# EasyEDA schematic SCH_ESP32-Collar-Module_2024-04-16.json
TITLE: Sheet_1; REV: 1.0; Date: 2024-04-14; Sheet: 1/1; Drawn By: fcbayernmunchenerlan999; Company: Your Company
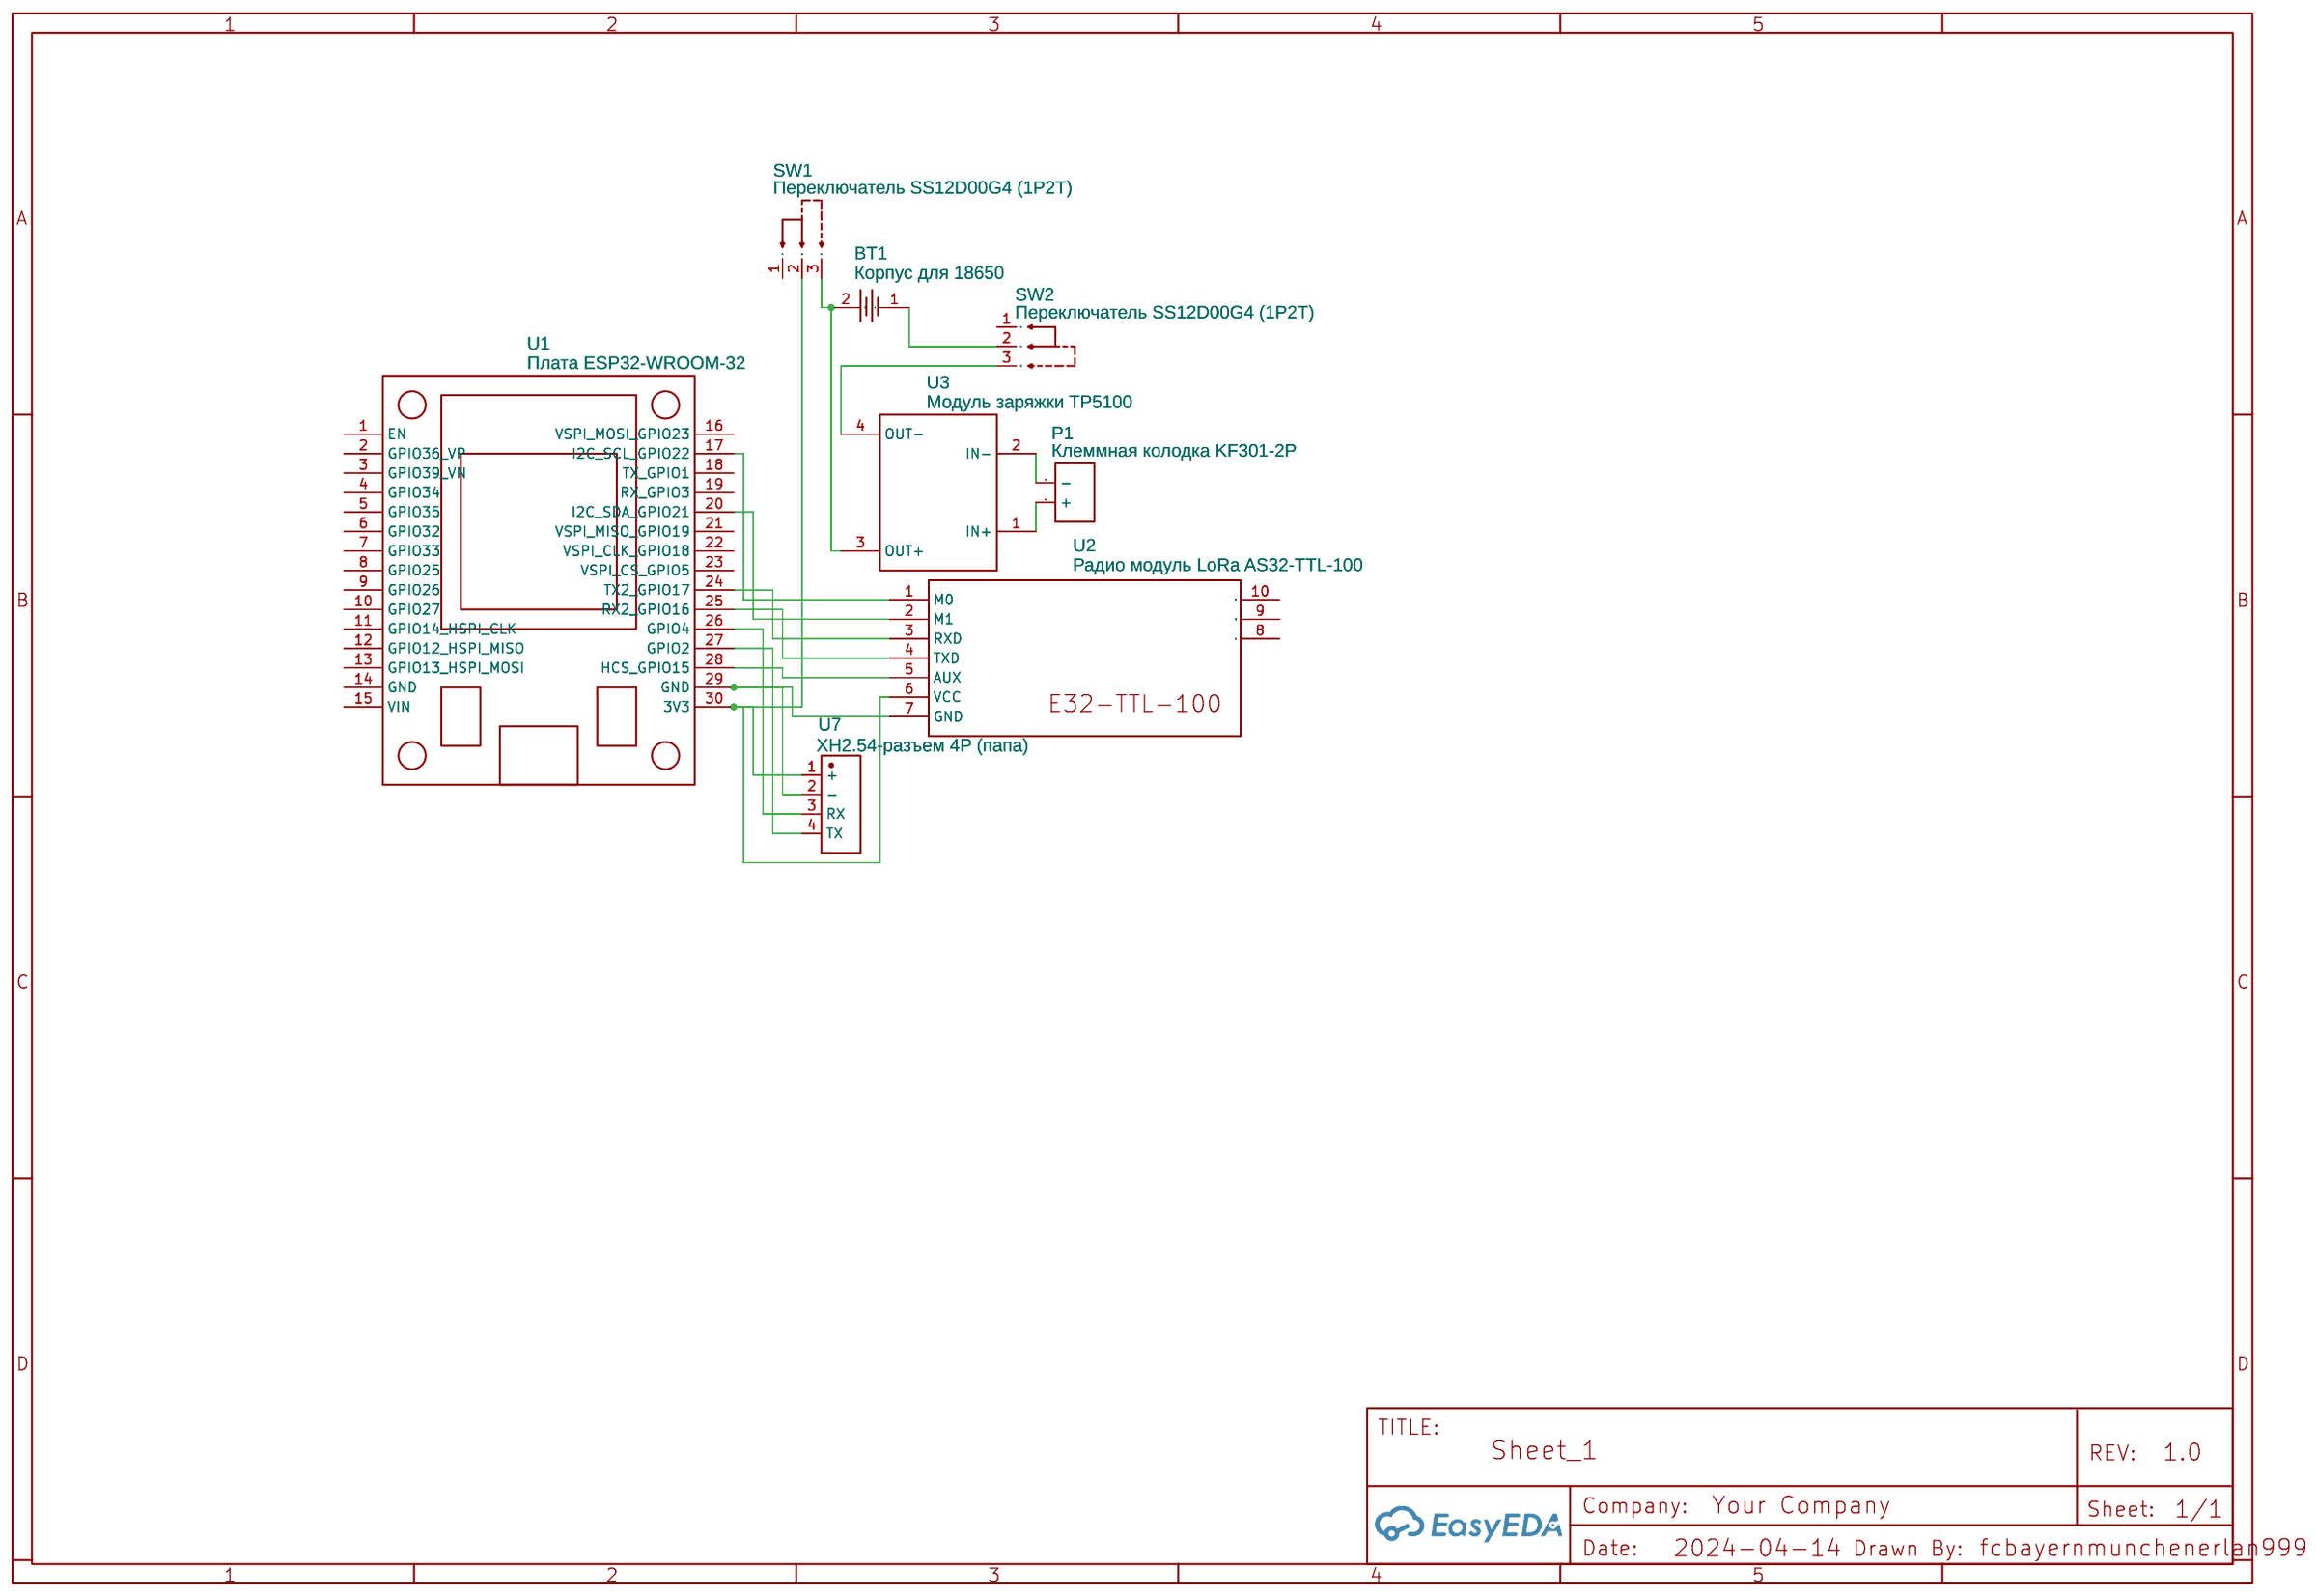
[diagram p0: schematic sheet]

## Parts
BT1  Корпус для 18650  [BAT-TH_BH-18650-A1AJ005]
P1  Клеммная колодка KF301-2P  [CONN-TH_2P-P5.00]
SW1  Переключатель SS12D00G4 (1P2T)  [SW-TH_G-SWITCH_SS-12E17-G020]
SW2  Переключатель SS12D00G4 (1P2T)  [SW-TH_G-SWITCH_SS-12E17-G020]
U1  Плата ESP32-WROOM-32  [ESP32S 30PIN DEVBOARD]
U2  Радио модуль LoRa AS32-TTL-100  [WIRELM-TH_E32-433T20DC]
U3  Модуль заряжки TP5100  [TP5100_MODULE_CHARGER]
U7  XH2.54-разъем 4P (папа)  [CONN-TH_4P-P2.50_ZX-XH2.54-4PWZ]

## Library data of the parts
BT1 = BH-18650-A1AJ005: Supplier: LCSC; Supplier Part: C5290176; Manufacturer: MYOUNG(美阳); JLCPCB Part Class: Extended Part; Contributor: lcsc; Package Display: No
P1 = CONN-TH_2P-P5.00: Supplier: LCSC; Contributor: LCEDA_Lib; Package Display: No
SW1 SW2 = SS-12E17-G020: Contributor: LCSC; Supplier: LCSC; Supplier Part: C2848909; Manufacturer: G-Switch(品赞); JLCPCB Part Class: Extended Part; Package Display: No
U1 = Плата ESP32 (вариант 2): Contributor: PhilD; Package Display: No
U2 = E32-TTL-100: Contributor: LCSC; Supplier: LCSC; Supplier Part: C97350; Manufacturer: EBYTE(亿佰特); Manufacturer Part: E32-433T20DC; JLCPCB Part Class: Extended Part; Package Display: No
U3 = TP5100_MODULE_CHARGER: Contributor: arve050; Package Display: No
U7 = ZX-XH2.54-4PWZ: Contributor: lcsc; Supplier: LCSC; Supplier Part: C7429643; Manufacturer: Megastar(兆星); JLCPCB Part Class: Extended Part; Package Display: No

## Nets
Net-(BT1-1): BT1.1 SW2.2
Net-(BT1-2): BT1.2 SW1.3 U3.3(OUT+)
Net-(P1-1): P1.1(-) U3.2(IN-)
Net-(P1-2): P1.2(+) U3.1(IN+)
Net-(SW1-2): SW1.2 U1.30(3V3) U2.6(VCC) U7.1(+)
Net-(SW2-3): SW2.3 U3.4(OUT-)
Net-(U1-17): U1.17(I2C SCL GPIO22) U2.1(M0)
Net-(U1-20): U1.20(I2C SDA GPIO21) U2.2(M1)
Net-(U1-24): U1.24(TX2 GPIO17) U2.3(RXD)
Net-(U1-25): U1.25(RX2 GPIO16) U2.4(TXD)
Net-(U1-26): U1.26(GPIO4) U7.3(RX)
Net-(U1-27): U1.27(GPIO2) U7.4(TX)
Net-(U1-28): U1.28(HCS GPIO15) U2.5(AUX)
Net-(U1-29): U1.29(GND) U2.7(GND) U7.2(-)

Not connected (* = marked no-connect by the designer): SW1 1; SW2 1; U1 1(EN) 2(GPIO36 VP) 3(GPIO39 VN) 4(GPIO34) 5(GPIO35) 6(GPIO32) 7(GPIO33) 8(GPIO25) 9(GPIO26) 10(GPIO27) 11(GPIO14 HSPI CLK) 12(GPIO12 HSPI MISO) 13(GPIO13 HSPI MOSI) 14(GND) 15(VIN) 16(VSPI MOSI GPIO23) 18(TX GPIO1) 19(RX GPIO3) 21(VSPI MISO GPIO19) 22(VSPI CLK GPIO18) 23(VSPI CS GPIO5); U2 8 9 10
